# Altium schematic sheet touch_panel.SchDoc
size A4
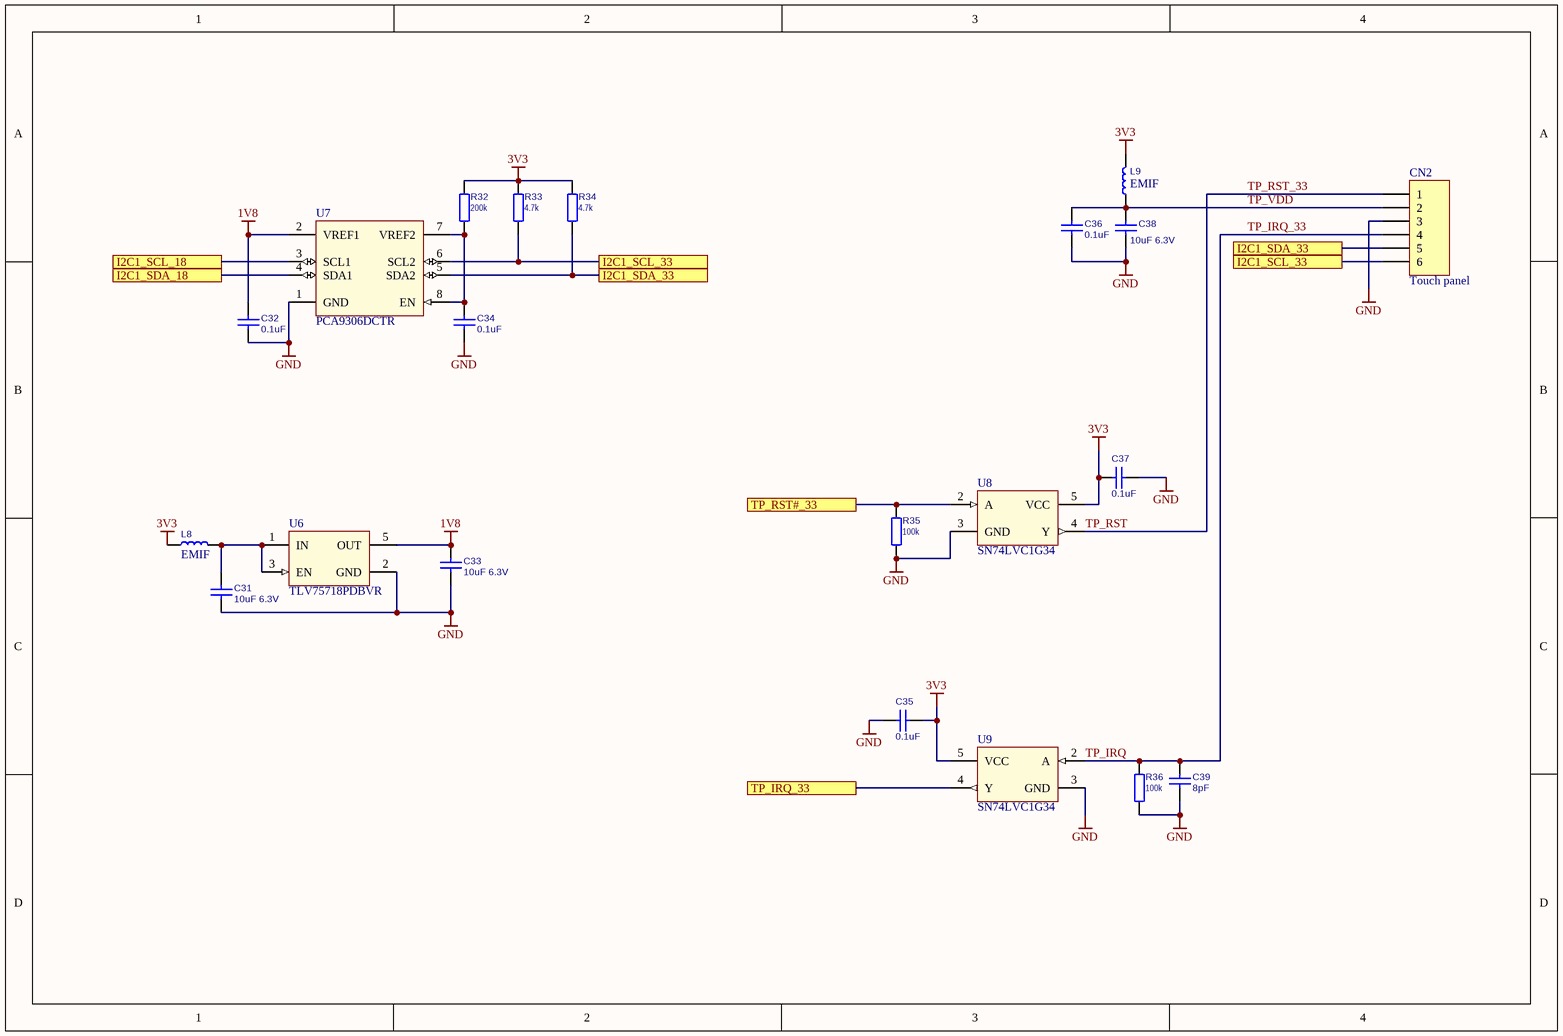
[diagram p0: touch_panel.SchDoc]

## Parts
C31  value 10uF 6.3V  [C0603]  (hidden comment: CC0603MRX5R5BB106)
C32  value 0.1uF  [C0603]  (hidden comment: C1608X7R1H104K080AA)
C33  value 10uF 6.3V  [C0603]  (hidden comment: CC0603MRX5R5BB106)
C34  value 0.1uF  [C0603]  (hidden comment: C1608X7R1H104K080AA)
C35  value 0.1uF  [C0603]  (hidden comment: C1608X7R1H104K080AA)
C36  value 0.1uF  [C0603]  (hidden comment: C1608X7R1H104K080AA)
C37  value 0.1uF  [C0603]  (hidden comment: C1608X7R1H104K080AA)
C38  value 10uF 6.3V  [C0603]  (hidden comment: CC0603MRX5R5BB106)
C39  value 8pF  [C0603]  (hidden comment: GRM1885C1H8R0DA01D)
CN2  Touch panel  [6S-0.5SH]
L8  value EMIF  [IND0603]  (hidden comment: BLM18AG102SN1D)
L9  value EMIF  [IND0603]  (hidden comment: BLM18AG102SN1D)
R32  200k  [R0603]
R33  4.7k  [R0603]
R34  4.7k  [R0603]
R35  value 100k  [R0603]  (hidden comment: 47k)
R36  value 100k  [R0603]  (hidden comment: 47k)
U6  TLV75718PDBVR  [SOT-23-5]
U7  PCA9306DCTR  [PSOP-8]
U8  SN74LVC1G34  [SOT-23-5]
U9  SN74LVC1G34  [SOT-23-5]

## Ports
I2C1_SCL_18, I2C1_SCL_33, I2C1_SDA_18, I2C1_SDA_33, TP_IRQ_33, TP_RST#_33

## Nets
1V8: C32.1 C33.1 U6.5(OUT) U7.2(VREF1)
3V3: C35.1 C37.1 L8.1 L9.2 R32.1 R33.1 R34.1 U8.5(VCC) U9.5(VCC)
GND: C31.2 C32.2 C33.2 C34.1 C35.2 C36.2 C37.2 C38.2 C39.2 CN2.3 R35.1 R36.1 U6.2(GND) U7.1(GND) U8.3(GND) U9.3(GND)
I2C1_SCL_18: U7.3(SCL1) ; port I2C1_SCL_18
I2C1_SCL_33: CN2.6 R33.2 U7.6(SCL2) ; port I2C1_SCL_33
I2C1_SDA_18: U7.4(SDA1) ; port I2C1_SDA_18
I2C1_SDA_33: CN2.5 R34.2 U7.5(SDA2) ; port I2C1_SDA_33
TP_IRQ: C39.1 CN2.4 R36.2 U9.2(A)  [also labelled TP_IRQ_33]
TP_IRQ_33: U9.4(Y) ; port TP_IRQ_33
TP_RST: CN2.1 U8.4(Y)  [also labelled TP_RST_33]
TP_RST#_33: R35.2 U8.2(A) ; port TP_RST#_33
TP_VDD: C36.1 C38.1 CN2.2 L9.1
NetC31_1: C31.1 L8.2 U6.1(IN) U6.3(EN)
NetC34_2: C34.2 R32.2 U7.7(VREF2) U7.8(EN)

## Library data of the parts
C31-C39 = CAP_NPOL
CN2 = Header 6: Header, 6-Pin; LatestRevisionDate: 17-Jul-2002; LatestRevisionNote: Re-released for DXP Platform.; Publisher: Altium Limited
L8 L9 = IND_WO_IRON
R32-R36 = RESISTOR: RES
  R32: Value: 200k
  R33 R34: Value: 4.7k
U6 = TLV733P: Capacitor-Free, 300-mA, Low-Dropout Regulator with Foldback Current Limit for Portable Devices; value: TLV733P
U7 = PCA9306: PCA9306 Dual Bidirectional I2C Bus and SMBus Voltage-Level Translator; value: PCA9306DCTR
U8 U9 = SN74LVC1G34: Single Buffer Gate; value: SN74LVC1G34